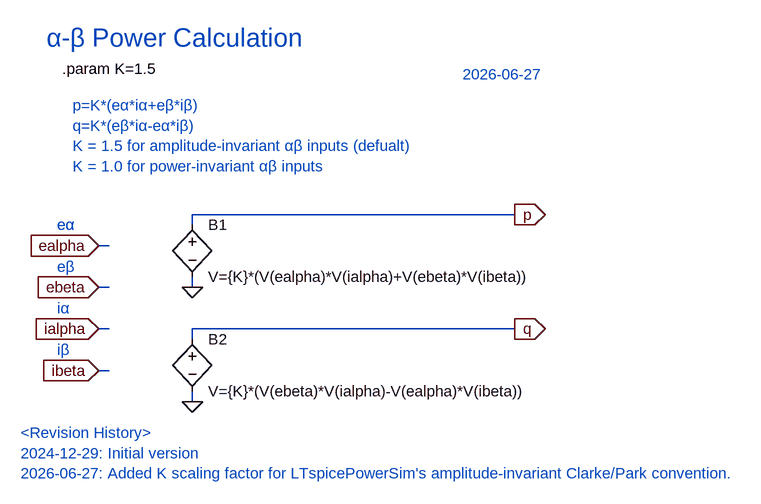
[diagram p0: schematic PQ_POWER.asc]
PQ_POWER.asc, the LTspice schematic file:
Version 4.1
SHEET 1 1432 680
WIRE 592 208 96 208
WIRE 96 224 96 208
WIRE -32 256 -48 256
WIRE -32 320 -48 320
WIRE 96 320 96 304
WIRE -32 384 -48 384
WIRE 592 384 96 384
WIRE 96 400 96 384
WIRE -32 448 -48 448
WIRE 96 496 96 480
FLAG -48 256 ealpha
IOPIN -48 256 In
FLAG -48 320 ebeta
IOPIN -48 320 In
FLAG -48 384 ialpha
IOPIN -48 384 In
FLAG -48 448 ibeta
IOPIN -48 448 In
FLAG 96 320 0
FLAG 592 208 p
IOPIN 592 208 Out
FLAG 96 496 0
FLAG 592 384 q
IOPIN 592 384 Out
SYMBOL bv 96 208 R0
SYMATTR InstName B1
SYMATTR Value V={K}*(V(ealpha)*V(ialpha)+V(ebeta)*V(ibeta))
SYMBOL bv 96 384 R0
SYMATTR InstName B2
SYMATTR Value V={K}*(V(ebeta)*V(ialpha)-V(ealpha)*V(ibeta))
TEXT -88 40 Left 2 ;p=K*(eα*iα+eβ*iβ)\nq=K*(eβ*iα-eα*iβ)\nK = 1.5 for amplitude-invariant αβ inputs (defualt)\nK = 1.0 for power-invariant αβ inputs
TEXT -128 -64 Left 4 ;α-β Power Calculation
TEXT -112 224 Left 2 ;eα
TEXT -112 224 Left 2 ;eα
TEXT -112 288 Left 2 ;eβ
TEXT -112 352 Left 2 ;iα
TEXT -112 416 Left 2 ;iβ
TEXT 512 -8 Left 2 ;2026-06-27
TEXT -104 -16 Left 2 !.param K=1.5
TEXT -168 544 Left 2 ;<Revision History>\n2024-12-29: Initial version\n2026-06-27: Added K scaling factor for LTspicePowerSim's amplitude-invariant Clarke/Park convention.

The netlist it stands for:
* PQ_POWER.asc
B1 p 0 V={K}*(V(ealpha)*V(ialpha)+V(ebeta)*V(ibeta))
B2 q 0 V={K}*(V(ebeta)*V(ialpha)-V(ealpha)*V(ibeta))
* p=K*(eα*iα+eβ*iβ)
* q=K*(eβ*iα-eα*iβ)
* K = 1.5 for amplitude-invariant αβ inputs (defualt)
* K = 1.0 for power-invariant αβ inputs
* α-β Power Calculation
* eα
* eα
* eβ
* iα
* iβ
* 2026-06-27
.param K=1.5
* <Revision History>
* 2024-12-29: Initial version
* 2026-06-27: Added K scaling factor for LTspicePowerSim's amplitude-invariant Clarke/Park convention.
.backanno
.end